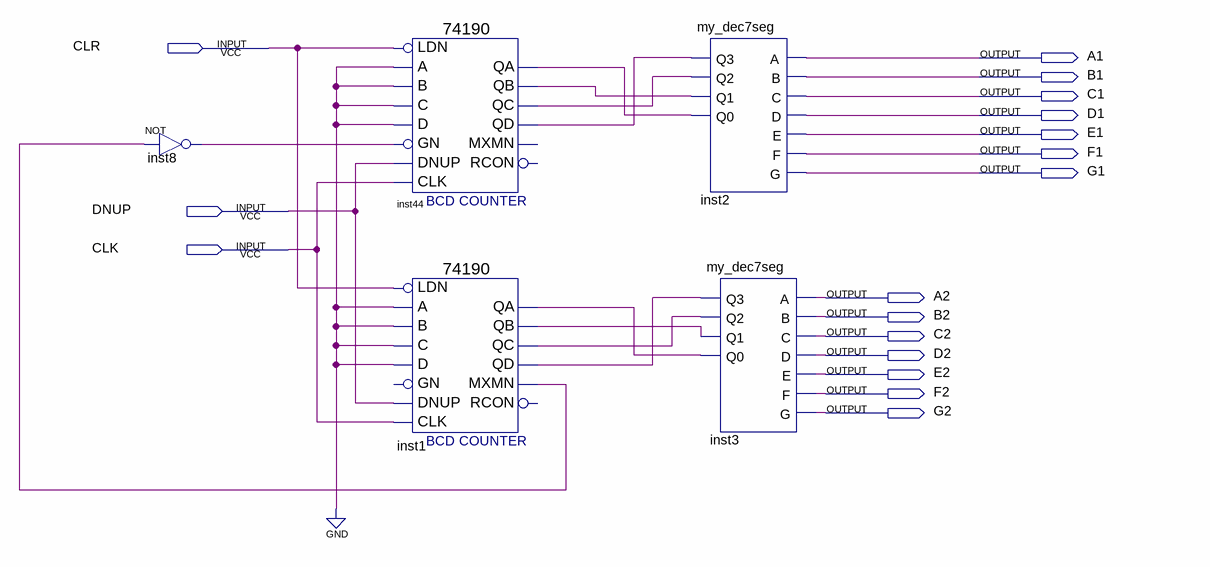
[diagram p0: schematic sheet]
// Quartus schematic contador_2dig.bdf as structural Verilog: 5 symbols, 17 pins
module contador_2dig (
  input  CLR,
  input  DNUP,
  input  CLK,
  output A1,
  output B1,
  output C1,
  output D1,
  output E1,
  output F1,
  output G1,
  output A2,
  output B2,
  output C2,
  output D2,
  output E2,
  output F2,
  output G2
);

  wire inst1_mxmn, inst1_qa, inst1_qb, inst1_qc, inst1_qd, inst8_out, inst44_qa, inst44_qb, inst44_qc,
       inst44_qd;

  not inst8 (inst8_out, inst1_mxmn);
  \74190  inst44 (
    .LDN(CLR), .A(1'b0), .C(1'b0), .B(1'b0), .D(1'b0), .GN(inst8_out), .CLK(CLK), .DNUP(DNUP),
    .QA(inst44_qa), .QB(inst44_qb), .QD(inst44_qd), .QC(inst44_qc));  // open: MXMN, RCON
  \74190  inst1 (
    .LDN(CLR), .A(1'b0), .C(1'b0), .B(1'b0), .D(1'b0), .CLK(CLK), .DNUP(DNUP), .QA(inst1_qa), .QB(inst1_qb),
    .QD(inst1_qd), .QC(inst1_qc), .MXMN(inst1_mxmn));  // open: GN, RCON
  my_dec7seg inst2 (
    .Q3(inst44_qd), .Q2(inst44_qc), .Q1(inst44_qb), .Q0(inst44_qa), .A(A1), .B(B1), .C(C1), .D(D1), .E(E1),
    .F(F1), .G(G1));
  my_dec7seg inst3 (
    .Q3(inst1_qd), .Q2(inst1_qc), .Q1(inst1_qb), .Q0(inst1_qa), .A(A2), .B(B2), .C(C2), .D(D2), .E(E2),
    .F(F2), .G(G2));
endmodule
